# Altium schematic sheet Main.SchDoc
size A3; SheetNumber: 1; SheetTotal: 2
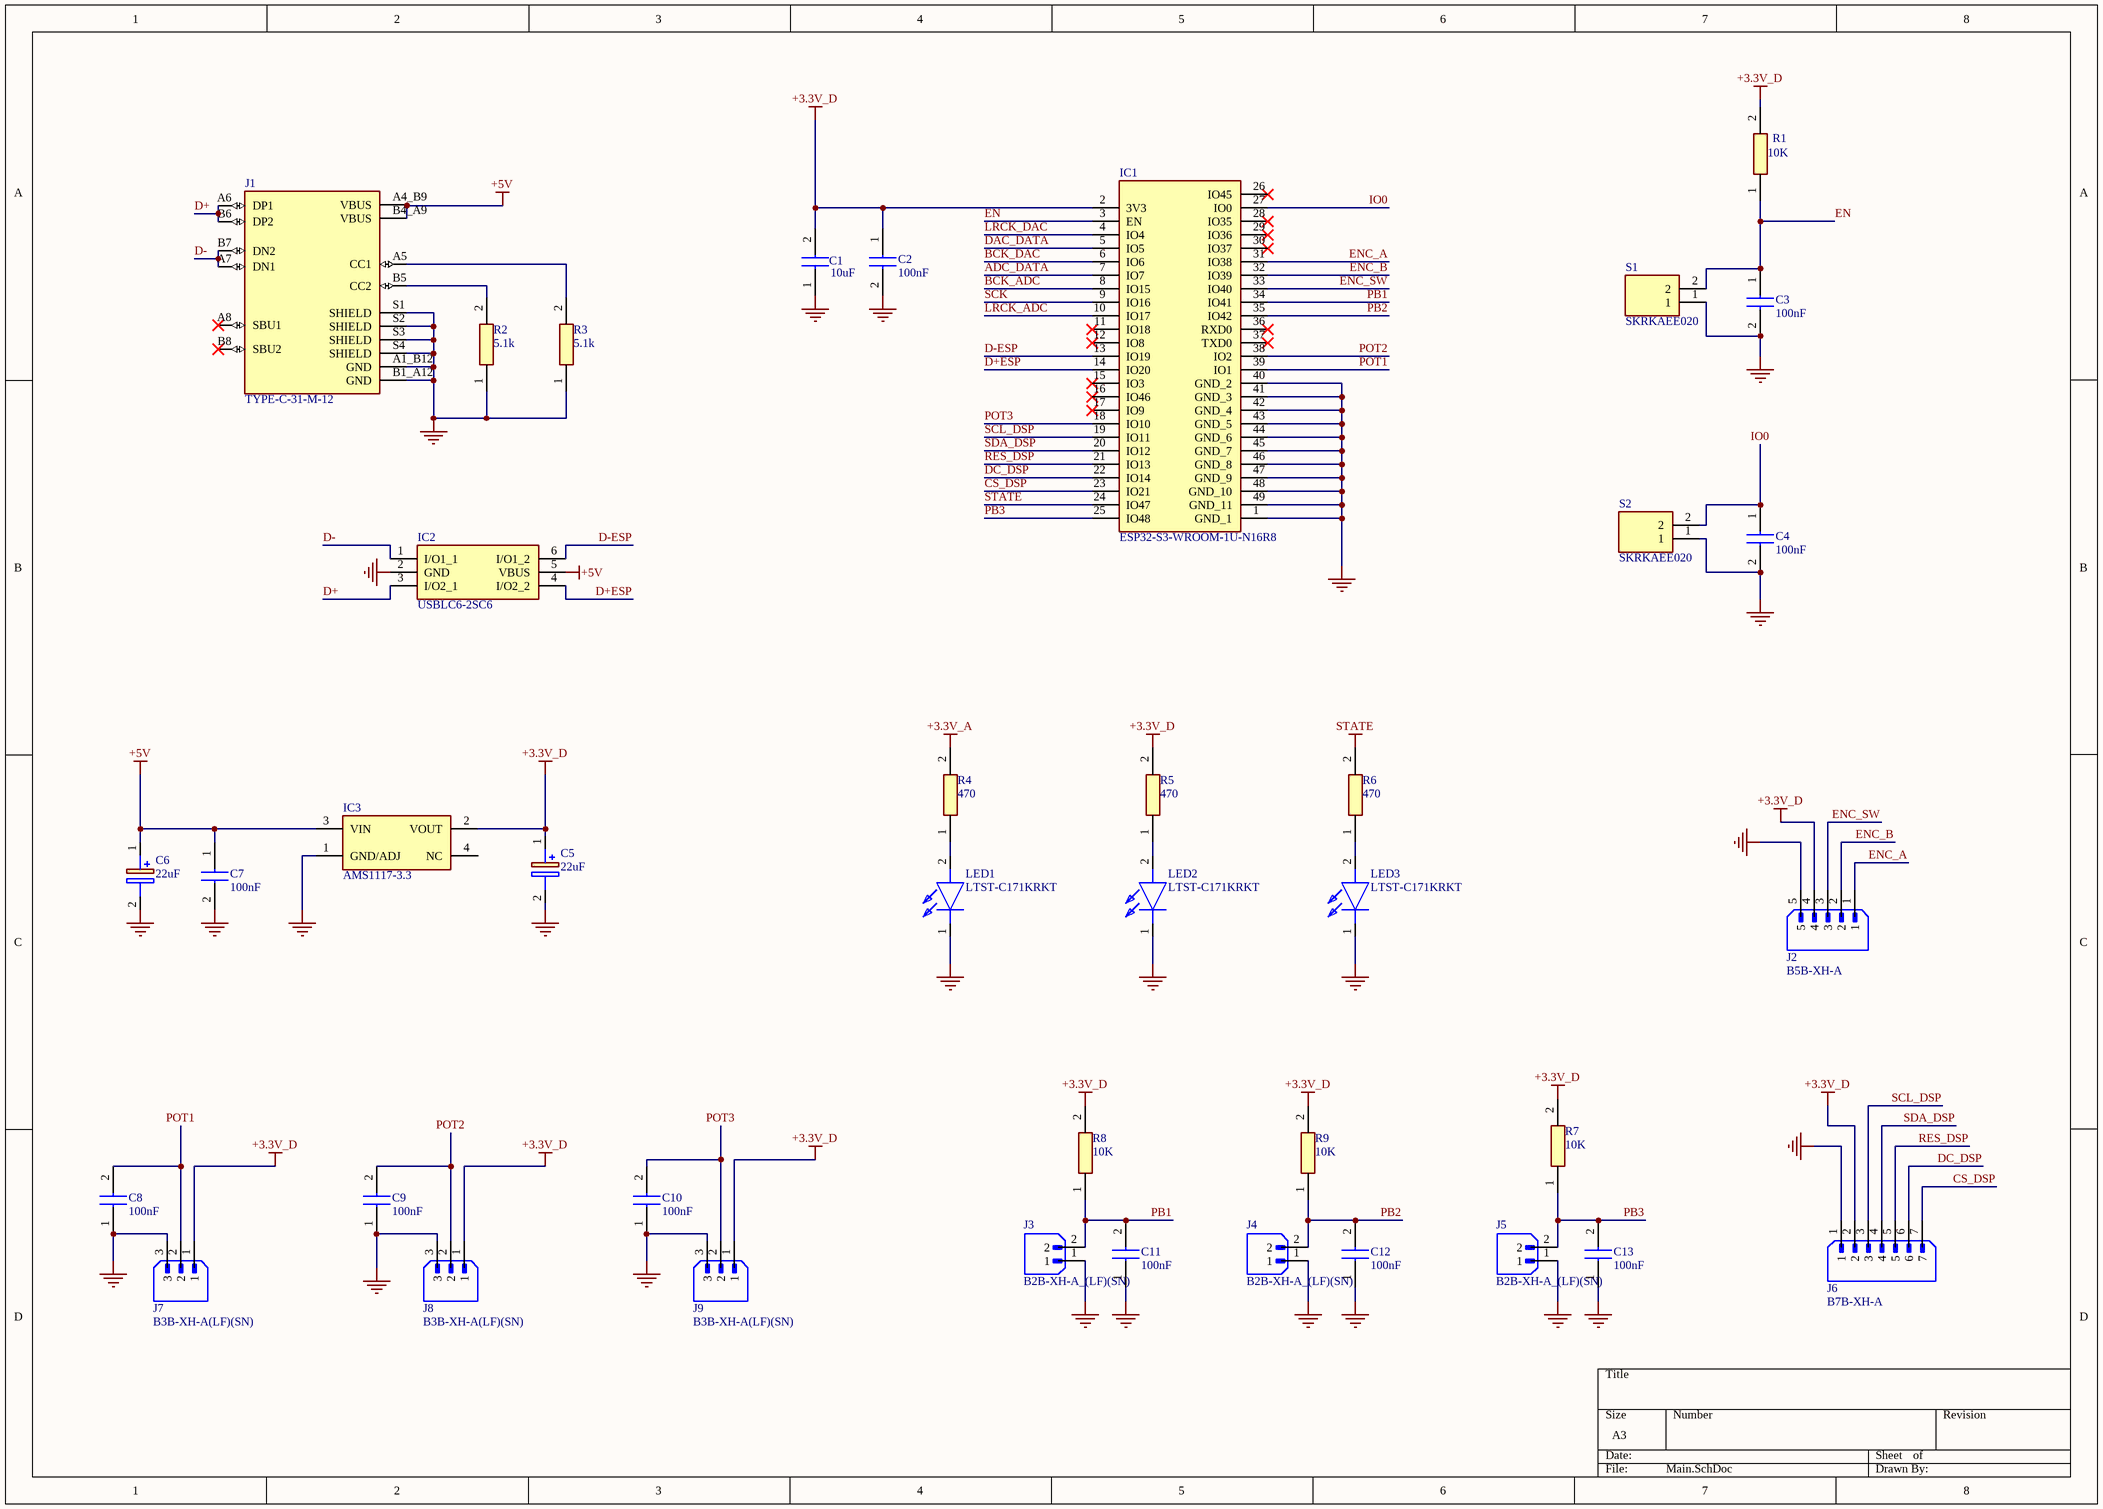
[diagram p0: Main.SchDoc]

## Parts
C1  10uF  [CAPC3216X180N]
C2  100nF  [CAPC1608X90N]
C3  100nF  [CAPC1608X90N]
C4  100nF  [CAPC1608X90N]
C5  22uF  [CAPAE430X590N]
C6  22uF  [CAPAE430X590N]
C7  100nF  [CAPC1608X90N]
C8  100nF  [CAPC1608X90N]
C9  100nF  [CAPC1608X90N]
C10  100nF  [CAPC1608X90N]
C11  100nF  [CAPC1608X90N]
C12  100nF  [CAPC1608X90N]
C13  100nF  [CAPC1608X90N]
IC1  ESP32-S3-WROOM-1U-N16R8  [ESP32S3WROOM1UN16R8]
IC2  USBLC6-2SC6  [SOT95P280X145-6N]
IC3  AMS1117-3.3  [SOT229P700X180-4N]
J1  TYPE-C-31-M-12  [HRO_TYPE-C-31-M-12]
J2  B5B-XH-A  [JST_B5B-XH-A]  (no BOM)
J3  B2B-XH-A_(LF)(SN)  [JST_B2B-XH-A_(LF)(SN)]  (no BOM)
J4  B2B-XH-A_(LF)(SN)  [JST_B2B-XH-A_(LF)(SN)]  (no BOM)
J5  B2B-XH-A_(LF)(SN)  [JST_B2B-XH-A_(LF)(SN)]  (no BOM)
J6  B7B-XH-A  [JST_B7B-XH-A]  (no BOM)
J7  B3B-XH-A(LF)(SN)  [JST_B3B-XH-A(LF)(SN)]  (no BOM)
J8  B3B-XH-A(LF)(SN)  [JST_B3B-XH-A(LF)(SN)]  (no BOM)
J9  B3B-XH-A(LF)(SN)  [JST_B3B-XH-A(LF)(SN)]  (no BOM)
LED1  LTST-C171KRKT  [LEDM2012X90N]
LED2  LTST-C171KRKT  [LEDM2012X90N]
LED3  LTST-C171KRKT  [LEDM2012X90N]
R1  10K  [RESC2012X60N]
R2  5.1k  [ERA6AEB101V]
R3  5.1k  [ERA6AEB101V]
R4  470  [ERA3AEB101V]
R5  470  [ERA3AEB101V]
R6  470  [ERA3AEB101V]
R7  10K  [RESC2012X60N]
R8  10K  [RESC2012X60N]
R9  10K  [RESC2012X60N]
S1  SKRKAEE020  [SKRKAEE020]
S2  SKRKAEE020  [SKRKAEE020]

## Nets
+3.3V_A: R4.2
+3.3V_D: C1.2 C2.1 C5.1(+) IC1.2(3V3) IC3.2(VOUT) J2.4 J6.2 J7.1 J8.1 J9.1 R1.2 R5.2 R7.2 R8.2 R9.2
+5V: C6.1(+) C7.1 IC2.5(VBUS) IC3.3(VIN) J1.A4_B9(VBUS) J1.B4_A9(VBUS)
GND: C1.1 C2.2 C3.2 C4.2 C5.2(-) C6.2(-) C7.2 C8.1 C9.1 C10.1 C11.1 C12.1 C13.1 IC1.1(GND_1) IC1.40(GND_2) IC1.41(GND_3) IC1.42(GND_4) IC1.43(GND_5) IC1.44(GND_6) IC1.45(GND_7) IC1.46(GND_8) IC1.47(GND_9) IC1.48(GND_10) IC1.49(GND_11) IC2.2(GND) IC3.1(GND/ADJ) J1.A1_B12(GND) J1.B1_A12(GND) J1.S1(SHIELD) J1.S2(SHIELD) J1.S3(SHIELD) J1.S4(SHIELD) J2.5 J3.1 J4.1 J5.1 J6.1 J7.3 J8.3 J9.3 LED1.1(K) LED2.1(K) LED3.1(K) R2.1 R3.1 S1.1 S2.1
STATE: IC1.24(IO47) R6.2
ADC_DATA: IC1.7(IO7)
BCK_ADC: IC1.8(IO15)
BCK_DAC: IC1.6(IO6)
CS_DSP: IC1.23(IO21) J6.7
D+: IC2.3(I/O2_1) J1.A6(DP1) J1.B6(DP2)
D+ESP: IC1.14(IO20) IC2.4(I/O2_2)
D-: IC2.1(I/O1_1) J1.A7(DN1) J1.B7(DN2)
D-ESP: IC1.13(IO19) IC2.6(I/O1_2)
DAC_DATA: IC1.5(IO5)
DC_DSP: IC1.22(IO14) J6.6
EN: C3.1 IC1.3(EN) R1.1 S1.2
ENC_A: IC1.31(IO38) J2.1
ENC_B: IC1.32(IO39) J2.2
ENC_SW: IC1.33(IO40) J2.3
IO0: C4.1 IC1.27(IO0) S2.2
LRCK_ADC: IC1.10(IO17)
LRCK_DAC: IC1.4(IO4)
PB1: C11.2 IC1.34(IO41) J3.2 R8.1
PB2: C12.2 IC1.35(IO42) J4.2 R9.1
PB3: C13.2 IC1.25(IO48) J5.2 R7.1
POT1: C8.2 IC1.39(IO1) J7.2
POT2: C9.2 IC1.38(IO2) J8.2
POT3: C10.2 IC1.18(IO10) J9.2
RES_DSP: IC1.21(IO13) J6.5
SCK: IC1.9(IO16)
SCL_DSP: IC1.19(IO11) J6.3
SDA_DSP: IC1.20(IO12) J6.4
NetJ1_A5: J1.A5(CC1) R3.2
NetJ1_B5: J1.B5(CC2) R2.2
NetLED1_2: LED1.2(A) R4.1
NetLED2_2: LED2.2(A) R5.1
NetLED3_2: LED3.2(A) R6.1

Not connected (* = marked no-connect by the designer): IC1 11(IO18)* 12(IO8)* 15(IO3)* 16(IO46)* 17(IO9)* 26(IO45)* 28(IO35)* 29(IO36)* 30(IO37)* 36(RXD0)* 37(TXD0)*; IC3 4(NC); J1 A8(SBU1)* B8(SBU2)*

## Library data of the parts
C1 = CL31A106KAHNNNE: Capacitor; Manufacturer_Name: SAMSUNG; Datasheet Link: https://datasheet.datasheetarchive.com/originals/distributors/Datasheets_SAMA/8c86add0e95aa125c91e23e767429ce6.pdf; Height: 1.8mm; Manufacturer_Part_Number: CL31A106KAHNNNE; Mouser Part Number: 187-CL31A106KAHNNNE; Mouser Price/Stock: https://www.mouser.co.uk/ProductDetail/Samsung-Electro-Mechanics/CL31A106KAHNNNE?qs=349EhDEZ59rSHw4%2FqTnHBg%3D%3D; Arrow Part Number: CL31A106KAHNNNE; Arrow Price/Stock: https://www.arrow.com/en/products/cl31a106kahnnne/samsung-electro-mechanics?utm_currency=USD&region=europe
C2-C4 C7-C13 = CL10B104KC8NNNC: Capacitor; Manufacturer_Name: SAMSUNG; Datasheet Link: https://datasheet.datasheetarchive.com/originals/distributors/DKDS-19/373511.pdf; Height: 0.9mm; Manufacturer_Part_Number: CL10B104KC8NNNC; Mouser Part Number: 187-CL10B104KC8NNNC; Mouser Price/Stock: https://www.mouser.co.uk/ProductDetail/Samsung-Electro-Mechanics/CL10B104KC8NNNC?qs=%2FukktrhNKsY5bKXvqblW4Q%3D%3D; Arrow Part Number: CL10B104KC8NNNC; Arrow Price/Stock: https://www.arrow.com/en/products/cl10b104kc8nnnc/samsung-electro-mechanics?utm_currency=USD&region=europe
C5 C6 = RVT1C220M0405: Capacitor Polarised; Manufacturer_Name: ROQANG; Datasheet Link: https://wmsc.lcsc.com/wmsc/upload/file/pdf/v2/lcsc/2304140030_CX-Dongguan-Chengxing-Elec-RVT1C220M0405_C81984.pdf; Height: 5.9mm; Manufacturer_Part_Number: RVT1C220M0405
IC1 = ESP32-S3-WROOM-1U-N16R8: Integrated Circuit; Manufacturer_Name: Espressif Systems; Datasheet Link: https://www.espressif.com/sites/default/files/documentation/esp32-s3-wroom-1_wroom-1u_datasheet_en.pdf; Height: 3.35mm; Manufacturer_Part_Number: ESP32-S3-WROOM-1U-N16R8; Mouser Part Number: 356-ESP32S3WM1UN16R8; Mouser Price/Stock: https://www.mouser.co.uk/ProductDetail/Espressif-Systems/ESP32-S3-WROOM-1U-N16R8?qs=Li%252BoUPsLEns6V0Pr5KRJtw%3D%3D
IC2 = USBLC6-2SC6: Integrated Circuit; Manufacturer_Name: STMicroelectronics; Datasheet Link: https://www.st.com/resource/en/datasheet/usblc6-2.pdf; Height: 1.45mm; Manufacturer_Part_Number: USBLC6-2SC6; Mouser Part Number: 511-USBLC6-2SC6; Mouser Price/Stock: https://www.mouser.co.uk/ProductDetail/STMicroelectronics/USBLC6-2SC6?qs=po45yt2pPpu%2FhNIlwQdTlg%3D%3D; Arrow Part Number: USBLC6-2SC6; Arrow Price/Stock: https://www.arrow.com/en/products/usblc6-2sc6/stmicroelectronics.html?utm_currency=USD&region=nac
IC3 = AMS1117-3.3: Integrated Circuit; Manufacturer_Name: Advanced; Datasheet Link: https://datasheet.datasheetarchive.com/originals/distributors/Datasheets-28/DSA-550594.pdf; Height: 1.8mm; Manufacturer_Part_Number: AMS1117-3.3
J1 = TYPE-C-31-M-12: USB Connectors 24 Receptacle 1 8.94*7.3mm RoHS; MF: HRO Electronics Co., Ltd.; SnapEDA_Link: https://www.snapeda.com/parts/TYPE-C-31-M-12/HRO+Electronics+Co.%252C+Ltd./view-part/?ref=snap; Package: Package; Value: *; MP: TYPE-C-31-M-12; Check_prices: https://www.snapeda.com/parts/TYPE-C-31-M-12/HRO+Electronics+Co.%252C+Ltd./view-part/?ref=eda; Manufacturer_Part_Number: TYPE-C-31-M-12
J2 = B5B-XH-A: Connector Header Through Hole 5 position 0.098 (2.50mm); MF: JST Sales; SnapEDA_Link: https://www.snapeda.com/parts/B5B-XH-A/JST+Sales+America+Inc./view-part/?ref=snap; Package: None; Value: *; MP: B5B-XH-A; Check_prices: https://www.snapeda.com/parts/B5B-XH-A/JST+Sales+America+Inc./view-part/?ref=eda
J3-J5 = B2B-XH-A_(LF)(SN): Connector Header Through Hole 2 position 0.098 (2.50mm); MF: JST Sales; MP: B2B-XH-A (LF)(SN); SnapEDA_Link: https://www.snapeda.com/parts/B2B-XH-A%20(LF)(SN)/JST+Sales+America+Inc./view-part/?ref=snap; Package: None; Value: *; Check_prices: https://www.snapeda.com/parts/B2B-XH-A%20(LF)(SN)/JST+Sales+America+Inc./view-part/?ref=eda
J6 = B7B-XH-A: Connector Header Through Hole 7 position 0.098 (2.50mm); MF: JST Sales; SnapEDA_Link: https://www.snapeda.com/parts/B7B-XH-A/JST+Sales+America+Inc./view-part/?ref=snap; Package: None; Value: *; MP: B7B-XH-A; Check_prices: https://www.snapeda.com/parts/B7B-XH-A/JST+Sales+America+Inc./view-part/?ref=eda
J7-J9 = B3B-XH-A(LF)(SN): Connector Header Through Hole 3 position 0.098 (2.50mm); MF: JST Sales; SnapEDA_Link: https://www.snapeda.com/parts/B3B-XH-A(LF)(SN)/JST/view-part/?ref=snap; Package: None; Value: *; MP: B3B-XH-A(LF)(SN); Check_prices: https://www.snapeda.com/parts/B3B-XH-A(LF)(SN)/JST/view-part/?ref=eda
LED1-LED3 = LTST-C171KRKT: LED; Manufacturer_Name: Lite-On; Datasheet Link: http://www.mouser.com/datasheet/2/239/Lite-On-LTST-C171KRKT-1175280.pdf; Height: 0.9mm; Manufacturer_Part_Number: LTST-C171KRKT; Mouser Part Number: 859-LTST-C171KRKT; Mouser Price/Stock: https://www.mouser.co.uk/ProductDetail/LITEON/LTST-C171KRKT?qs=5XMAZBf2SiSTcAb1f5vDzw%3D%3D; Arrow Part Number: LTST-C171KRKT; Arrow Price/Stock: https://www.arrow.com/en/products/ltst-c171krkt/lite-on-technology?utm_currency=USD&region=nac
R1 R7-R9 = AC0805JR-0710KL: Resistor; Manufacturer_Name: Yageo Group; Datasheet Link: https://www.yageo.com/upload/media/product/productsearch/datasheet/rchip/PYu-AC_51_RoHS_L_10.pdf; Height: 0.6mm; Manufacturer_Part_Number: AC0805JR-0710KL; Mouser Part Number: 603-AC0805JR-0710KL; Mouser Price/Stock: https://www.mouser.co.uk/ProductDetail/YAGEO/AC0805JR-0710KL?qs=ygRr%2Ftkhtes%252BG%252B8d7tcP9w%3D%3D
R2 R3 = ERA-6AED512V: Resistor; Manufacturer_Name: Panasonic; Datasheet Link: https://industrial.panasonic.com/cdbs/www-data/pdf/RDM0000/AOA0000C307.pdf; Height: 0.6mm; Manufacturer_Part_Number: ERA-6AED512V; Mouser Part Number: 667-ERA-6AED512V; Mouser Price/Stock: https://www.mouser.co.uk/ProductDetail/Panasonic/ERA-6AED512V?qs=MNPzkKEzRtSyMhgZIjuV%252BA%3D%3D; Arrow Part Number: ERA-6AED512V; Arrow Price/Stock: https://www.arrow.com/en/products/era-6aed512v/panasonic?region=nac
R4-R6 = ERA-3AEB471V: Resistor; Manufacturer_Name: Panasonic; Datasheet Link: https://industrial.panasonic.com/cdbs/www-data/pdf/RDM0000/AOA0000C307.pdf; Height: 0.55mm; Manufacturer_Part_Number: ERA-3AEB471V; Mouser Part Number: 667-ERA-3AEB471V; Mouser Price/Stock: https://www.mouser.co.uk/ProductDetail/Panasonic/ERA-3AEB471V?qs=1VWA5LkbEaqH3cm2W5TUkw%3D%3D; Arrow Part Number: ERA-3AEB471V; Arrow Price/Stock: https://www.arrow.com/en/products/era3aeb471v/panasonic
S1 S2 = SKRKAEE020: Switch; Manufacturer_Name: ALPS Electric; Datasheet Link: http://www.alps.com/prod/info/J/HTML/Tact/SurfaceMount/SKRK/SKRKAEE020.html; Height: 2mm; Manufacturer_Part_Number: SKRKAEE020; Mouser Part Number: 688-SKRKAEE020; Mouser Price/Stock: https://www.mouser.co.uk/ProductDetail/Alps-Alpine/SKRKAEE020?qs=MrosSN5%252BUQW89XjXIp8Ugw%3D%3D